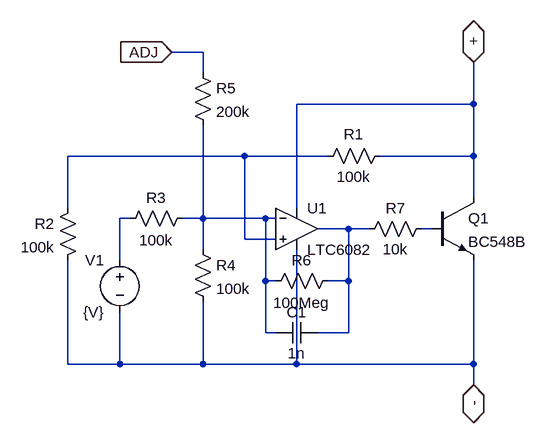
[diagram p0: schematic lm336.asc]
lm336.asc, the LTspice schematic file:
Version 4
SHEET 1 940 680
WIRE 400 -32 352 -32
WIRE 400 0 400 -32
WIRE 816 48 816 -16
WIRE 816 48 544 48
WIRE 464 128 192 128
WIRE 592 128 464 128
WIRE 816 128 816 48
WIRE 816 128 672 128
WIRE 816 192 816 128
WIRE 192 208 192 128
WIRE 544 208 544 48
WIRE 288 224 272 224
WIRE 400 224 400 80
WIRE 400 224 368 224
WIRE 496 224 400 224
WIRE 512 224 496 224
WIRE 624 240 576 240
WIRE 656 240 624 240
WIRE 752 240 736 240
WIRE 464 256 464 128
WIRE 512 256 464 256
WIRE 400 272 400 224
WIRE 272 288 272 224
WIRE 496 320 496 224
WIRE 512 320 496 320
WIRE 624 320 624 240
WIRE 624 320 592 320
WIRE 496 400 496 320
WIRE 512 400 496 400
WIRE 624 400 624 320
WIRE 624 400 576 400
WIRE 192 448 192 288
WIRE 272 448 272 368
WIRE 272 448 192 448
WIRE 400 448 400 352
WIRE 400 448 272 448
WIRE 544 448 544 272
WIRE 544 448 400 448
WIRE 816 448 816 288
WIRE 816 448 544 448
WIRE 816 480 816 448
FLAG 816 -16 +
IOPIN 816 -16 BiDir
FLAG 352 -32 ADJ
IOPIN 352 -32 In
FLAG 816 480 -
IOPIN 816 480 BiDir
SYMBOL voltage 272 272 M0
SYMATTR InstName V1
SYMATTR Value {V}
SYMBOL res 688 112 R90
WINDOW 0 -2 56 VBottom 2
WINDOW 3 32 56 VTop 2
SYMATTR InstName R1
SYMATTR Value 100k
SYMBOL res 208 192 M0
SYMATTR InstName R2
SYMATTR Value 100k
SYMBOL res 272 240 R270
WINDOW 0 32 56 VTop 2
WINDOW 3 -2 56 VBottom 2
SYMATTR InstName R3
SYMATTR Value 100k
SYMBOL res 384 256 R0
SYMATTR InstName R4
SYMATTR Value 100k
SYMBOL res 384 -16 R0
SYMATTR InstName R5
SYMATTR Value 200k
SYMBOL res 496 336 R270
WINDOW 0 32 56 VTop 2
WINDOW 3 -2 56 VBottom 2
SYMATTR InstName R6
SYMATTR Value 100Meg
SYMBOL npn 752 192 R0
SYMATTR InstName Q1
SYMATTR Value BC548B
SYMBOL res 640 256 R270
WINDOW 0 32 56 VTop 2
WINDOW 3 0 56 VBottom 2
SYMATTR InstName R7
SYMATTR Value 10k
SYMBOL cap 576 384 R90
WINDOW 0 0 32 VBottom 2
WINDOW 3 32 32 VTop 2
SYMATTR InstName C1
SYMATTR Value 1n
SYMBOL OpAmps\\LTC6082 544 240 R0
SYMATTR InstName U1

The netlist it stands for:
* lm336.asc
V1 N002 - {V}
R1 + N001 100k
R2 N001 - 100k
R3 N002 N003 100k
R4 N003 - 100k
R5 ADJ N003 200k
R6 N003 N004 100Meg
Q1 + N005 - 0 BC548B
R7 N004 N005 10k
C1 N004 N003 1n
* U1: LTC6082 (symbol OpAmps\LTC6082 not available, pins judged from their places): In+=N001 In-=N003 V+=+ V-=- OUT=N004
.model NPN NPN
.model PNP PNP
.lib standard.bjt
.backanno
.end